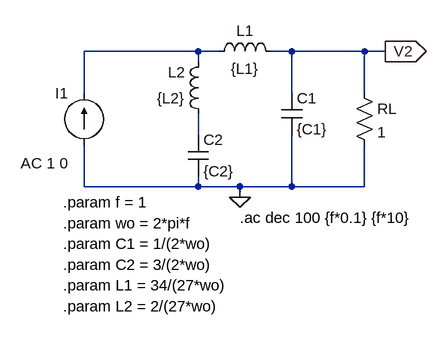
[diagram p0: schematic EJ2.asc]
EJ2.asc, the LTspice schematic file:
Version 4
SHEET 1 880 680
WIRE 160 48 -16 48
WIRE 192 48 160 48
WIRE 304 48 272 48
WIRE 416 48 304 48
WIRE 448 48 416 48
WIRE 160 64 160 48
WIRE -16 112 -16 48
WIRE 304 112 304 48
WIRE 416 112 416 48
WIRE 160 176 160 144
WIRE -16 256 -16 192
WIRE 160 256 160 240
WIRE 160 256 -16 256
WIRE 224 256 160 256
WIRE 304 256 304 176
WIRE 304 256 224 256
WIRE 416 256 416 192
WIRE 416 256 304 256
WIRE 224 272 224 256
FLAG 224 272 0
FLAG 448 48 V2
IOPIN 448 48 Out
SYMBOL current -16 192 R180
WINDOW 0 24 80 Left 2
WINDOW 3 24 0 Left 2
WINDOW 123 24 -28 Left 2
WINDOW 39 0 0 Left 0
SYMATTR InstName I1
SYMATTR Value ""
SYMATTR Value2 AC 1 0
SYMBOL ind 176 160 R180
WINDOW 0 36 80 Left 2
WINDOW 3 36 40 Left 2
SYMATTR InstName L2
SYMATTR Value {L2}
SYMBOL cap 144 176 R0
SYMATTR InstName C2
SYMATTR Value {C2}
SYMBOL ind 176 64 R270
WINDOW 0 32 56 VTop 2
WINDOW 3 5 56 VBottom 2
SYMATTR InstName L1
SYMATTR Value {L1}
SYMBOL cap 288 112 R0
SYMATTR InstName C1
SYMATTR Value {C1}
SYMBOL res 400 96 R0
SYMATTR InstName RL
SYMATTR Value 1
TEXT -48 280 Left 2 !.param f = 1
TEXT -48 312 Left 2 !.param wo = 2*pi*f
TEXT -48 344 Left 2 !.param C1 = 1/(2*wo)
TEXT -48 376 Left 2 !.param C2 = 3/(2*wo)
TEXT -48 408 Left 2 !.param L1 = 34/(27*wo)
TEXT -48 440 Left 2 !.param L2 = 2/(27*wo)
TEXT 224 304 Left 2 !.ac dec 100 {f*0.1} {f*10}

The netlist it stands for:
* EJ2.asc
I1 0 N001 AC 1 0
L2 N002 N001 {L2}
C2 N002 0 {C2}
L1 N001 V2 {L1}
C1 V2 0 {C1}
RL V2 0 1
.param f = 1
.param wo = 2*pi*f
.param C1 = 1/(2*wo)
.param C2 = 3/(2*wo)
.param L1 = 34/(27*wo)
.param L2 = 2/(27*wo)
.ac dec 100 {f*0.1} {f*10}
.backanno
.end

* Results of the author's LTspice run, read from the files saved beside the schematic
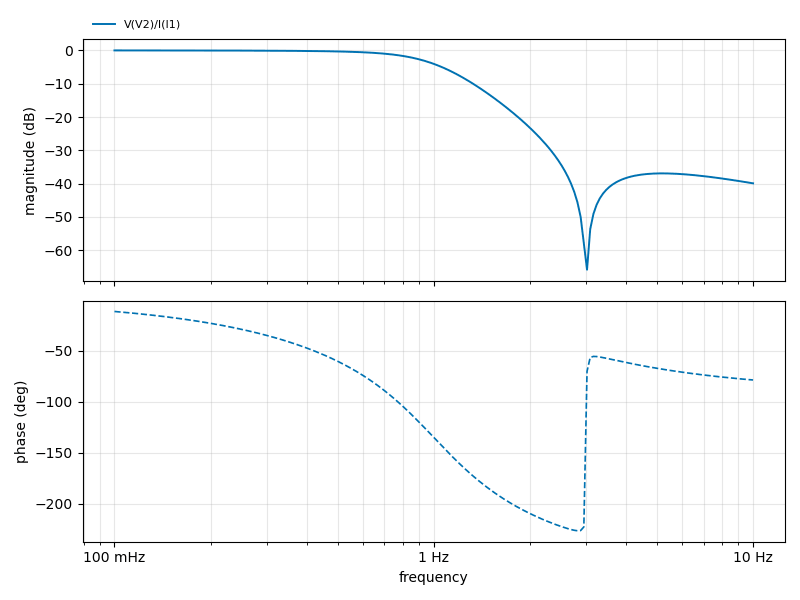
[diagram p1: AC Analysis of EJ2.asc, plotted from the saved traces]
* AC Analysis, 1 run:
*   V(V2)/I(I1): -0.01 dB at 100 mHz, -39.90 dB at 10 Hz, peak -0.01 dB at 100 mHz, 3 dB below the peak at 926.4 mHz